# EAGLE design v3SchemaSimonComplet (EAGLE 9.6.2)
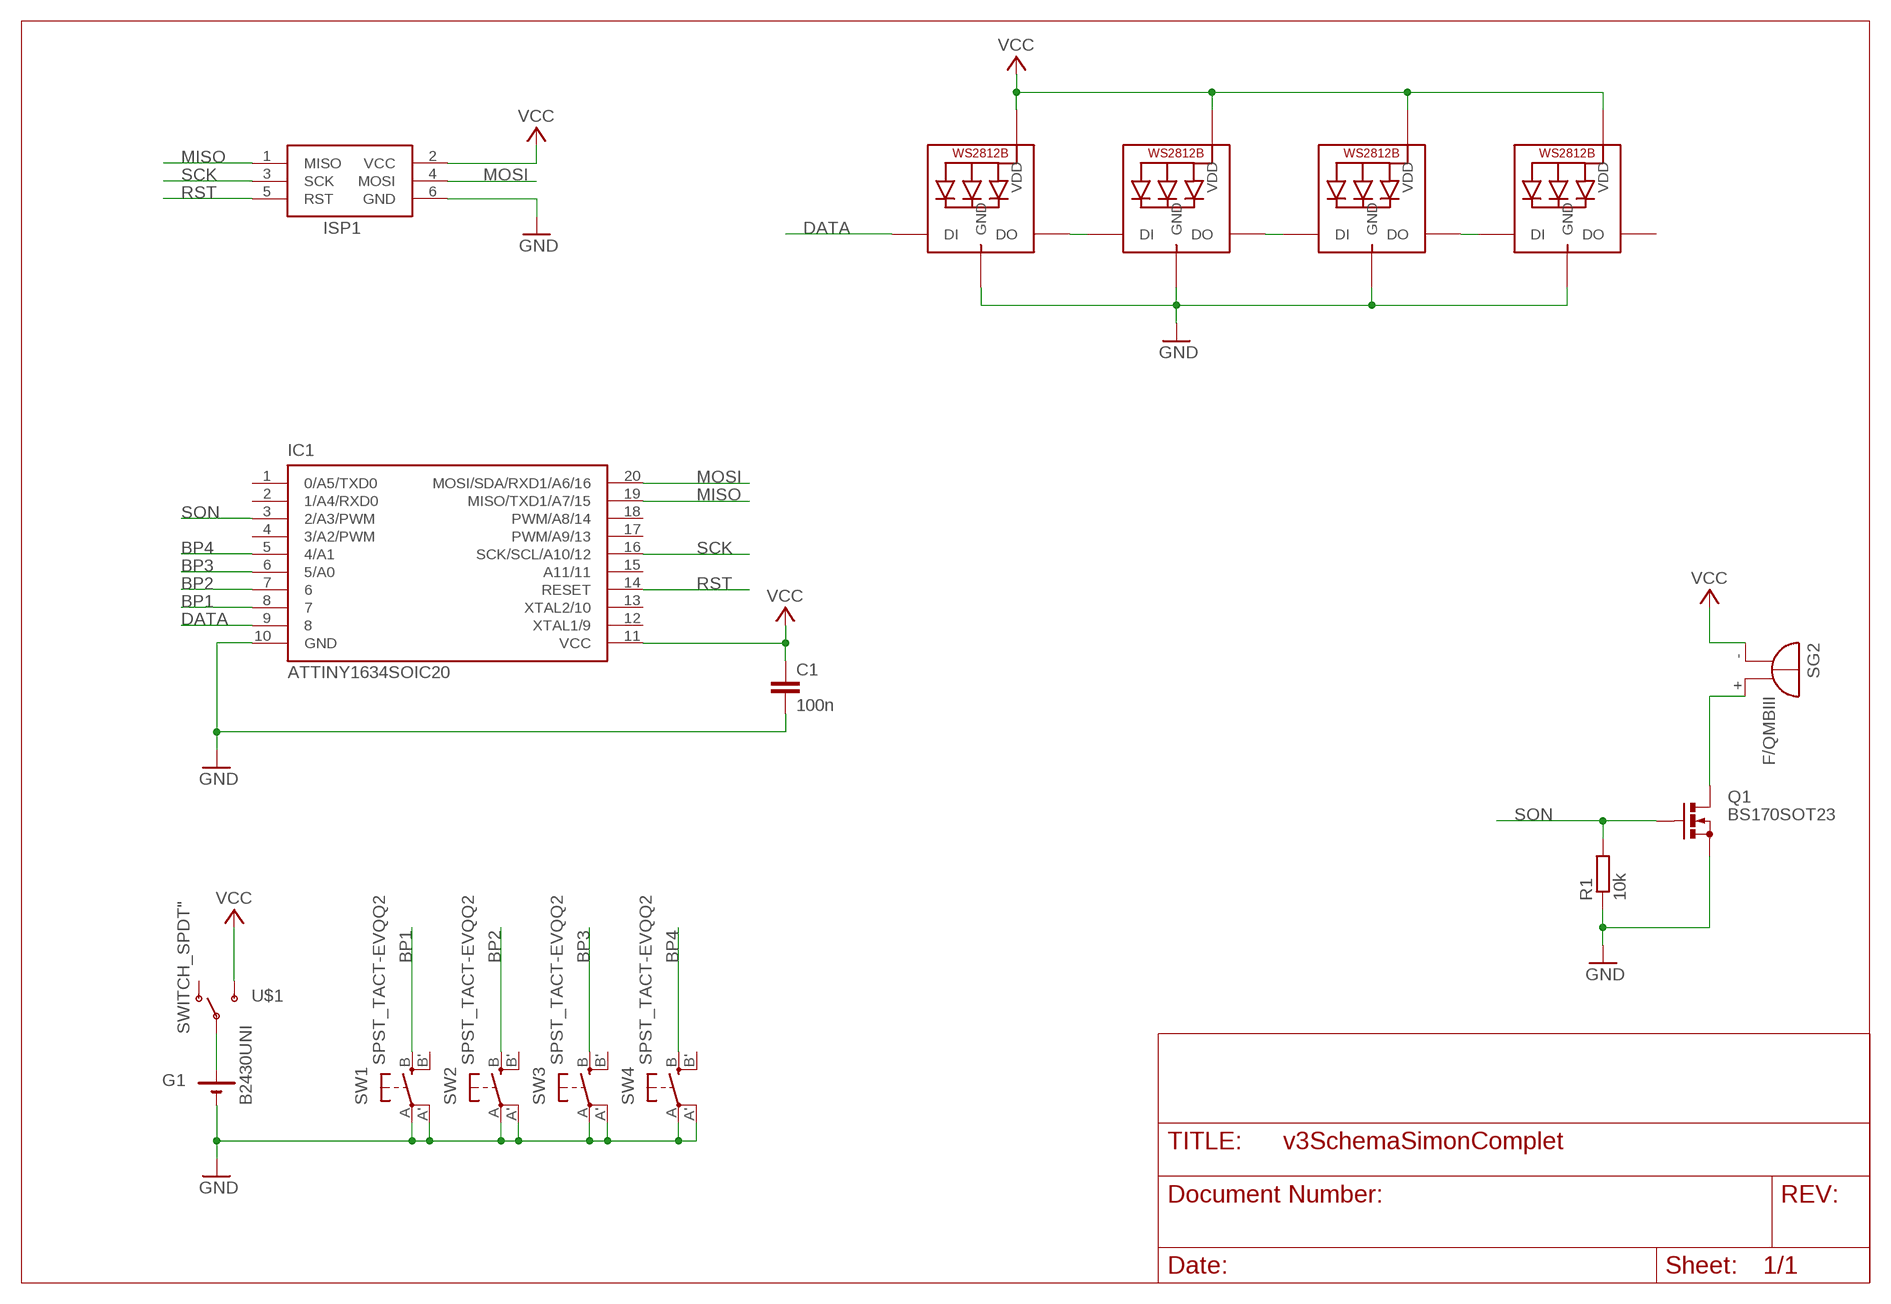
[diagram p0: schematic, sheet 1]

## Parts
C1  100n  C-EUC1206  [C1206]
G1  B2430UNI  [B2430UNI]
IC1  ATTINY1634SOIC20  [SOIC20]
ISP1  AVRISP-6  [AVRISP]
LED1  WS2812B5050  [WS2812B]
LED2  WS2812B5050  [WS2812B]
LED3  WS2812B5050  [WS2812B]
LED4  WS2812B5050  [WS2812B]
Q1  BS170SOT23  [SOT23]
R1  10k  R-EUR1206  [R1206]
SG2  F/QMBIII  [F/QMBIII]
SW1  SPST_TACT-EVQQ2  [EVQ-Q2]
SW2  SPST_TACT-EVQQ2  [EVQ-Q2]
SW3  SPST_TACT-EVQQ2  [EVQ-Q2]
SW4  SPST_TACT-EVQQ2  [EVQ-Q2]
U$1  SWITCH_SPDT"  [CMS-CL-SB-12A-02T]

## Nets
BP1: IC1.8 SW1.B(S)
BP2: IC1.7 SW2.B(S)
BP3: IC1.6(5/A0) SW3.B(S)
BP4: IC1.5(4/A1) SW4.B(S)
DATA: IC1.9 LED1.4-DIN(DI)
GND: C1.2 G1.-@1(-) IC1.10(GND) ISP1.6(GND) LED1.3-GND(GND) LED2.3-GND(GND) LED3.3-GND(GND) LED4.3-GND(GND) Q1.2(S) R1.1 SW1.A'(P1) SW1.A(P) SW2.A'(P1) SW2.A(P) SW3.A'(P1) SW3.A(P) SW4.A'(P1) SW4.A(P)
MISO: IC1.19(MISO/TXD1/A7/15) ISP1.1(MISO)
MOSI: IC1.20(MOSI/SDA/RXD1/A6/16) ISP1.4(MOSI)
N$5: LED1.2-DOUT(DO) LED2.4-DIN(DI)
N$6: LED2.2-DOUT(DO) LED3.4-DIN(DI)
N$7: LED3.2-DOUT(DO) LED4.4-DIN(DI)
N$8: G1.+@1(+) U$1.2(P)
N$9: Q1.3(D) SG2.+(-)
RST: IC1.14(RESET) ISP1.5(RST)
SCK: IC1.16(SCK/SCL/A10/12) ISP1.3(SCK)
SON: IC1.3(2/A3/PWM) Q1.1(G) R1.2
VCC: C1.1 IC1.11(VCC) ISP1.2(VCC) LED1.1-VDD(VDD) LED2.1-VDD(VDD) LED3.1-VDD(VDD) LED4.1-VDD(VDD) SG2.-(+) U$1.3(S)
Unconnected: IC1.1(0/A5/TXD0) IC1.2(1/A4/RXD0) IC1.4(3/A2/PWM) IC1.12(XTAL1/9) IC1.13(XTAL2/10) IC1.15(A11/11) IC1.17(PWM/A9/13) IC1.18(PWM/A8/14) LED4.2-DOUT(DO) SW1.B'(S1) SW2.B'(S1) SW3.B'(S1) SW4.B'(S1) U$1.1(O)

## Library data of the parts
C1 = LivetProjet:C-EU: CAPACITOR, European symbol
G1 = LivetProjet:B2430UNI: LI BATTERY
IC1 = LivetProjet:ATTINY1634
ISP1 = LivetProjet:AVRISP: AVR ISP HEADER Standard 6 pin header for AVR programming
LED1-LED4 = adafruit:WS2812B
Q1 = LivetProjet:BS170: N-CHANNEL MOS FET
R1 = LivetProjet:R-EU: RESISTOR, European symbol
SG2 = buzzer:F/QMBIII: BUZZER Source: Buerklin; OC_FARNELL: unknown; OC_NEWARK: unknown
SW1-SW4 = LivetProjet:SPST_TACT: SMT 6mm switch, EVQQ2 series http://www.ladyada.net/library/eagle
U$1 = LivetProjet:SWITCH_SPDT: SWCH-10651 Side-actuated SPDT slide switch, as used on the Arduino Pro

## Board
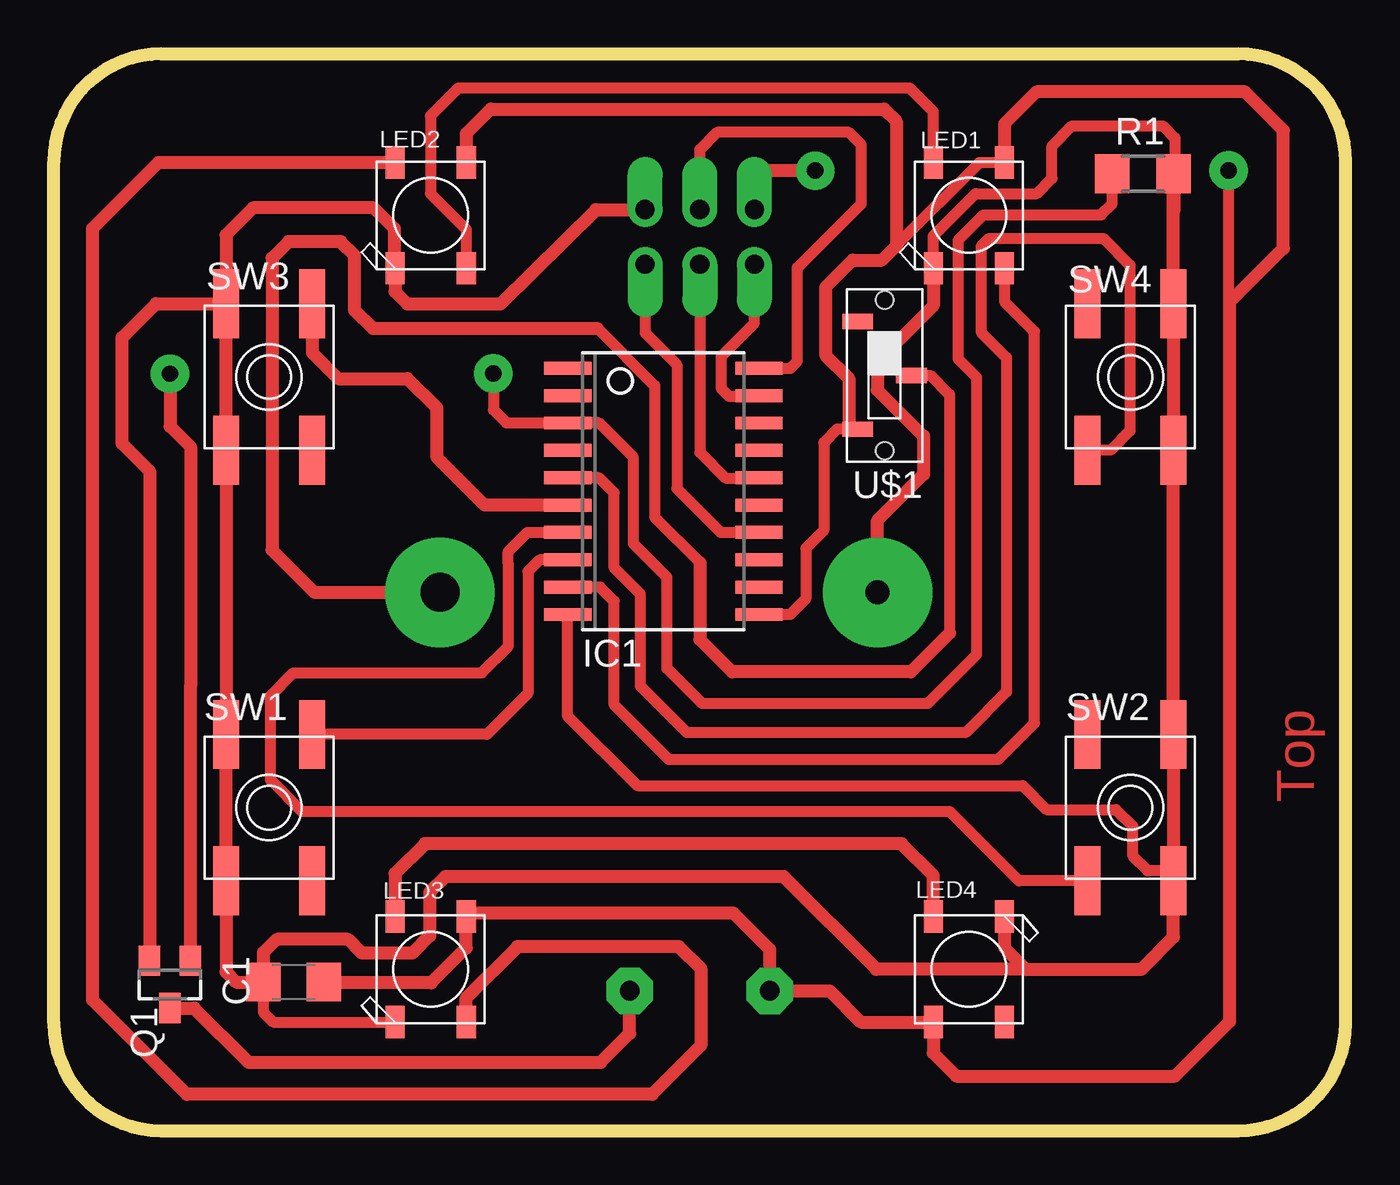
[diagram p1: board, top side]
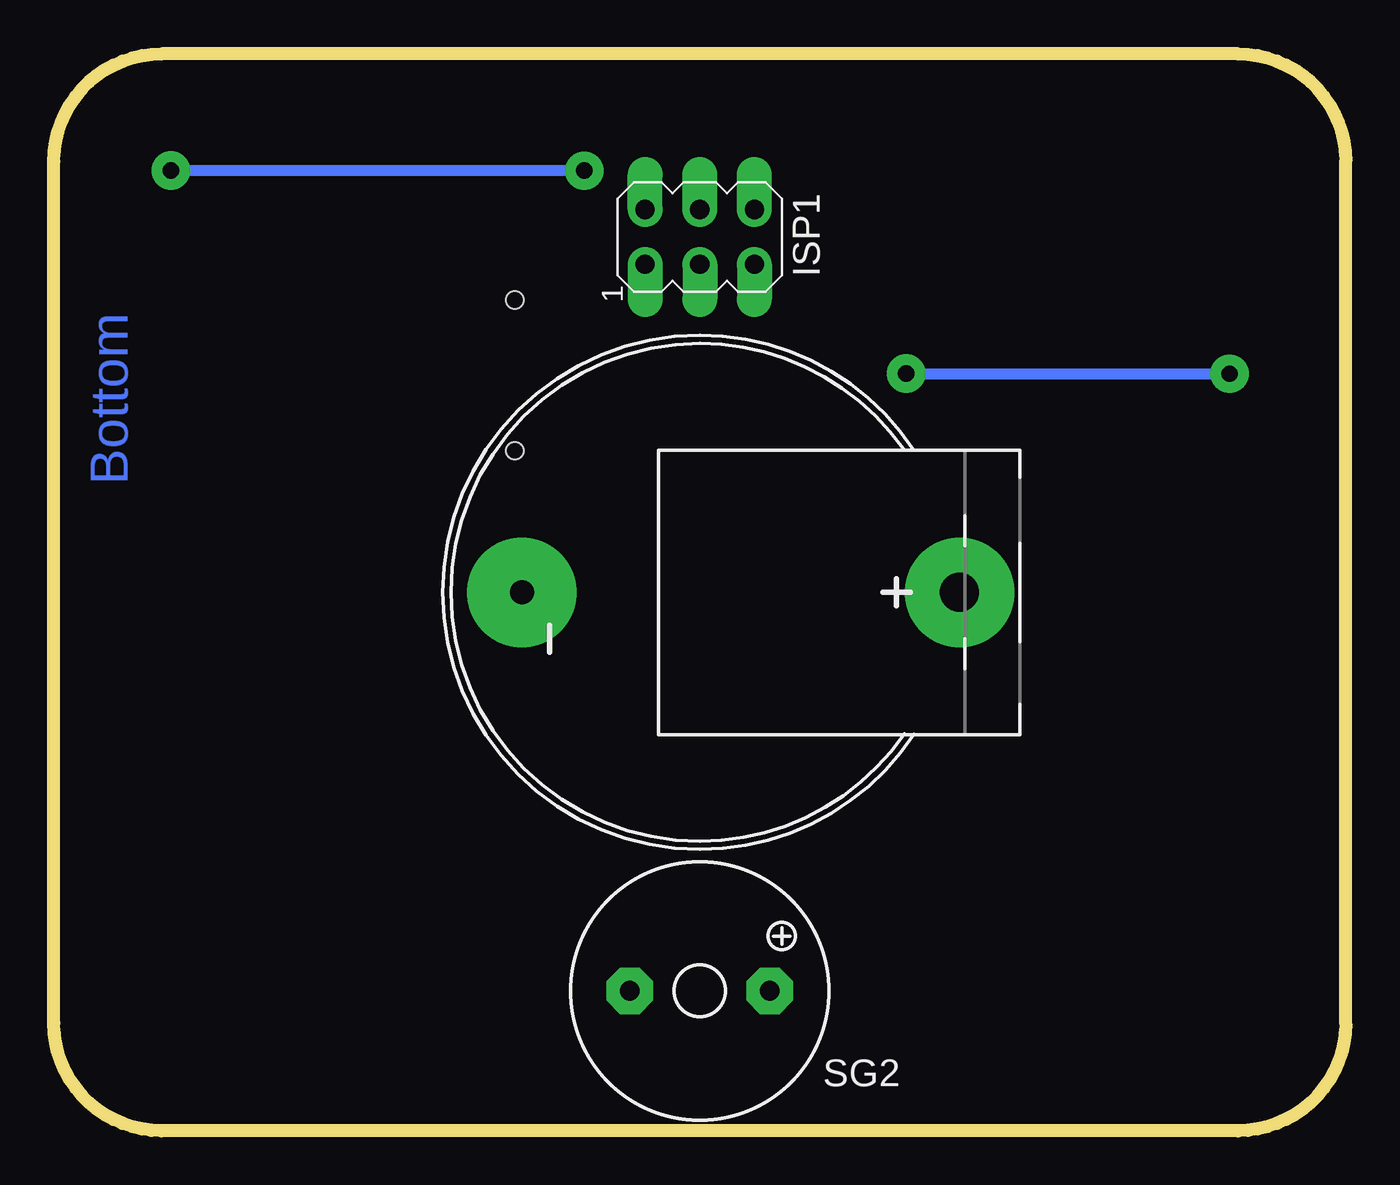
[diagram p2: board, bottom side, seen from below]

Size 60 x 50 mm. Coordinates in mm from the lower left corner, seen from the top.
Outline: 5,50 55,50 arc-90 60,45 60,5 arc-90 55,0 5,0 arc-90 0,5 0,45 arc-90 5,50
Copper layers (1*16): Top 0.035mm / dielectric 1.5mm / Bottom 0.035mm
Design rules "default *": minimum track width 6mil, minimum drill 0.35mm, track to track 15mil, track to pad 15mil, pad to pad 15mil, via to via 15mil, smd to smd 6mil, copper to edge 40mil, drill to drill 6mil, minimum pad ring 10mil, minimum via ring 8mil, stop-mask expansion 4mil, vias tented up to drill 0mil, thermal gap 10mil

### Footprints (pad centres in the part's own frame; a part is rotated, then mirrored left to right if it is on the bottom)
C1206 = smd 1.6 x 1.8: 1 -1.4,0; 2 1.4,0
B2430UNI = drill 1.803 pad 5.08: +@1 0,12.065 | drill 1.118 pad 5.08: -@1 0,-8.255
SOIC20 = smd 0.6 x 2.2: 1 0,-0.025; 2 1.27,-0.025; 3 2.54,-0.025; 4 3.81,-0.025; 5 5.08,-0.025; 6 6.35,-0.025; 7 7.62,-0.025; 8 8.89,-0.025; 9 10.16,-0.025; 10 11.43,-0.025; 11 11.43,8.865; 12 10.16,8.865; 13 8.89,8.865; 14 7.62,8.865; 15 6.35,8.865; 16 5.08,8.865; 17 3.81,8.865; 18 2.54,8.865; 19 1.27,8.865; 20 0,8.865
AVRISP = drill 0.9 pad 1.626 offset: 1 -1.27,2.54; 2 1.27,2.54; 3 -1.27,0; 4 1.27,0; 5 -1.27,-2.54; 6 1.27,-2.54
WS2812B = smd 1.5 x 0.9: 1-VDD 2.45,-1.65; 2-DOUT 2.45,1.65; 3-GND -2.45,1.65; 4-DIN -2.45,-1.65
SOT23 = smd 1 x 1.4: 1 -0.95,-1.1; 2 0.95,-1.1; 3 0,1.1
R1206 = smd 1.6 x 1.803: 1 -1.422,0; 2 1.422,0
F/QMBIII = drill 0.914 pad 2.159 octagon: + 3.251,0; - -3.251,0
EVQ-Q2 = smd 3.2 x 1.2: A -3.4,-2; A' 3.4,-2; B -3.4,2; B' 3.4,2
CMS-CL-SB-12A-02T = smd 0.711 x 1.422: 1 -3.5,-1.5; 2 -1,1; 3 1.5,-1.5 | hole 0.8: -4.5,-0.25; 2.5,-0.25

### Placement (x,y rotation side)
C1  11.13,6.9 180 top
G1  30,25 270 bottom
IC1  23.89,35.4 270 top
ISP1  30,41.5 90 bottom
LED1  42.5,42.5 90 top
LED2  17.5,42.5 90 top
LED3  17.5,7.5 90 top
LED4  42.5,7.5 270 top
Q1  5.4,6.8 180 top
R1  50.58,44.43 180 top
SG2  30,6.5 0 bottom
SW1  10,15 270 top
SW2  50,15 90 top
SW3  10,35 270 top
SW4  50,35 90 top
U$1  38.83,34.07 270 top

### Tracks (layer width: path | path; a pad name or v marks a point on that pad's centre or on a via)
BP1
  Top 0.508: SW1.B 20.11,18.4 22.02,20.31 22.02,25.97 22.56,26.51 IC1.8
BP2
  Top 0.508: SW2.B 44.83,11.6 41.61,14.81 11.54,14.81 10.06,16.29 10.06,20.19 11.13,21.26 19.87,21.26 21.11,22.5 21.11,26.32 21.1,26.32 21.1,26.89 21.99,27.78 IC1.7
BP3
  Top 0.508: IC1.6
  Top 0.61: IC1.6 20.01,29.05 17.78,31.28 17.78,33.56 16.41,34.92 13.21,34.92 12,36.13 SW3.B
BP4
  Top 0.508: IC1.5 23.87,30.31 25.33,30.31 26.03,29.61 26.03,26.13 27.24,24.92 27.24,20.65 29.41,18.48 42.35,18.48 44.25,20.38 44.25,35.89 43.06,37.08 43.06,41.06 43.44,41.44 48.73,41.44 49.98,40.19 49.98,32.5 49.09,31.6 SW4.B
DATA
  Top 0.508: LED1.4-DIN 44.15,38.5 45.55,37.1 45.55,18.92 43.87,17.25 28.55,17.25 26.03,19.77 26.03,24.59 25.38,25.24 IC1.9 | IC1.9
GND
  Top 0.508: LED1.3-GND 40.85,41.55 42.81,43.51 45.65,43.51 46.35,44.22 46.35,45.72 47.29,46.65 51.51,46.65 52.07,46.09 52.07,42.75 52,42.68 | IC1.10 23.85,23.95 23.85,19.27 27.1,16.02 45,16.02 46.11,14.91 49.34,14.91 50.12,14.13 50.12,12.75 50.8,12.06 51.53,12.06 SW2.A | C1.2 9.73,5.51 10.19,5.05 LED3.3-GND
  Top 0.61: SW3.A 8,41.6 9.25,42.85 14.85,42.85 15.81,41.9 15.81,40.09 LED2.3-GND 15.85,38.96 16.42,38.4 20.75,38.4 25.18,42.77 ISP1.6 | SW3.A SW3.A' SW1.A SW1.A' 8,7.38 8.48,6.9 C1.2 9.73,8.27 10.36,8.89 13.66,8.89 14.31,8.25 16.66,8.25 17.46,9.05 17.46,11.09 18.17,11.8 33.89,11.8 38.2,7.5 45.16,7.5 | LED1.3-GND 40.85,38.31 38.25,35.71 38.25,34.39 40.4,32.25 40.4,30.48 38.26,28.34 G1.-@1 | 45.16,7.5 44.15,8.51 LED4.3-GND | 45.16,7.5 50.5,7.5 52,9 SW2.A SW2.A' SW4.A SW4.A' 52,42.68 R1.1 | Q1.2 4.45,30.63 3.17,31.9 3.17,36.83 4.75,38.4 SW3.A
MISO
  Top 0.508: IC1.19 32.72,34.1 31.36,34.1 31,34.46 31,35.96 32.54,37.5 ISP1.1
MOSI
  Top 0.508: IC1.20 34.21,35.4 34.54,35.73 34.54,40.07 37.5,43.04 37.5,45.78 36.93,46.35 30.8,46.35 30,45.55 ISP1.4
N$5
  Top 0.508: LED1.2-DOUT 40.85,47.32 39.76,48.41 18.78,48.41 17.49,47.13 17.49,43.51 19.15,41.85 LED2.4-DIN
N$6
  Top 0.61: LED3.4-DIN 19.15,6.17 21.53,8.55 29.02,8.55 30.05,7.53 30.05,3.96 27.79,1.69 6.18,1.69 1.79,6.08 1.79,41.88 4.85,44.95 LED2.2-DOUT
N$7
  Top 0.61: LED4.4-DIN 40.85,11.86 39.37,13.33 17.23,13.33 15.85,11.95 LED3.2-DOUT
N$8
  Top 0.508: 41.6,23.11 41.6,34.17 40.71,35.07 U$1.2 | 25.25,37.25 27.9,34.6 27.9,28.49 30,26.39
  Top 0.61: 25.25,37.25 14.82,37.25 13.97,38.1 13.97,40.64 13.32,41.29 10.9,41.29 10.13,40.52 10.13,26.96 12.11,24.98 17.91,24.98 G1.+@1 | 41.6,23.11 39.8,21.31 31.5,21.31 30,22.81 30,26.39
N$9
  Top 0.61: SG2.+ 26.75,4.52 25.4,3.17 9.05,3.17 6.53,5.7 Q1.3
RST
  Top 0.508: ISP1.5 27.46,37.04 28.94,35.56 28.94,29.82 30.97,27.78 IC1.14
SCK
  Top 0.508: IC1.16 32.73,30.3 31.2,30.3 30,31.5 ISP1.3
SON  (via drill 0.76 pad 1.78)
  Top 0.508: R1.2 49.16,43.05 48.63,42.52 43.18,42.52 42,41.34 42,35.84 42.86,34.98 42.86,22.11 40.58,19.83 30.12,19.83 28.48,21.47 28.48,25.71 26.92,27.27 26.92,31.26 25.32,32.87 IC1.3 | IC1.3 | v20.42,35.15 20.42,33.47 21.02,32.87 IC1.3 | 6.35,20.64 6.35,20.65
  Top 0.61: Q1.1 6.35,20.64 | 6.35,20.65 6.35,31.75 5.39,32.71 v5.39,35.15
  Bottom 0.508: v20.42,35.15 v5.4,35.15 v5.39,35.15
VCC  (via drill 0.76 pad 1.78)
  Top 0.508: IC1.11 34.2,23.98 34.92,24.7 34.92,27.04 35.76,27.88 35.76,31.95 36.38,32.57 U$1.3 | 19.3,10.1 LED3.1-VDD | v54.57,44.59 54.56,44.58 54.56,38.53 54.61,38.48 | LED1.1-VDD 42.98,44.95 39.16,41.13
  Top 0.61: LED2.1-VDD 19.15,46.3 20.29,47.44 38.56,47.44 39.13,46.87 39.13,41.1 | LED3.1-VDD 19.15,8.49 17.53,6.87 12.57,6.87 C1.1 | LED1.1-VDD 44.15,46.75 45.64,48.23 55.32,48.23 57.1,46.45 57.1,40.97 54.61,38.48 54.61,5.08 52.07,2.54 41.91,2.54 40.85,3.6 LED4.1-VDD 37.49,5.05 36.05,6.5 SG2.- 33.25,8.4 31.56,10.1 19.3,10.1 | U$1.3 36.92,32.57 36.92,34.93 35.84,36.01 35.84,39.15 37.1,40.42 38.45,40.42 39.13,41.1 | v35.37,44.58 33.01,44.58 32.54,44.1 ISP1.2 | 39.13,41.1 39.16,41.13
  Bottom 0.508: v35.37,44.58 54.56,44.58 v54.57,44.59

### Text on the board
Top: Top
Bottom: Bottom